# Altium schematic sheet RearBreakoutSchematic.SchDoc
size A; SheetNumber: 1; SheetTotal: 4
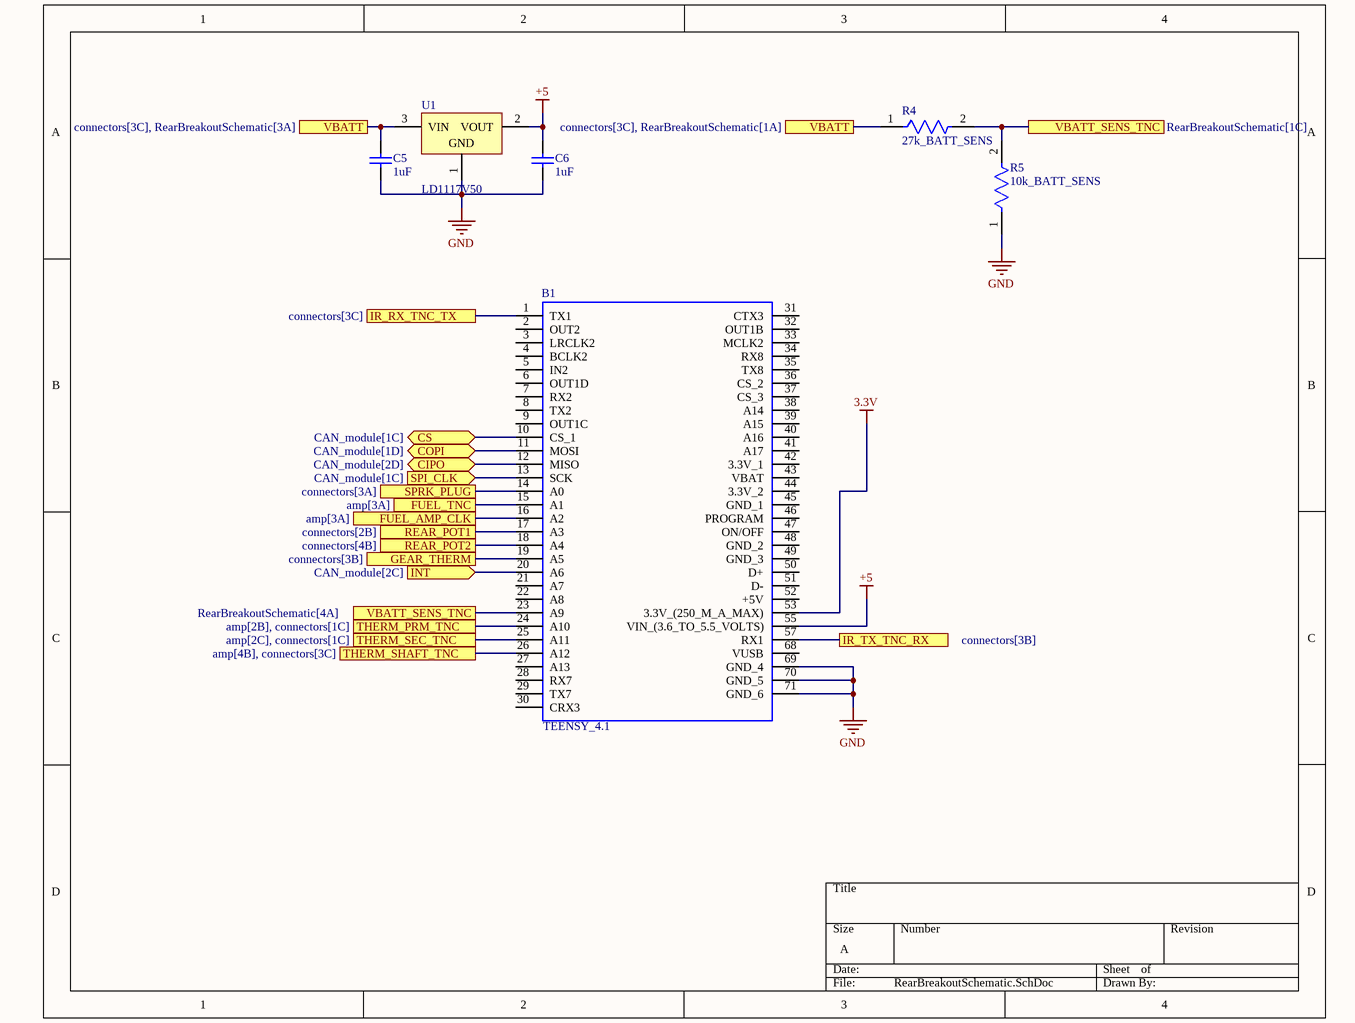
[diagram p0: RearBreakoutSchematic.SchDoc]

## Parts
B1  TEENSY_4.1  [TEENSY41]
C5  1uF  [CAPC2013X145X50LL20T25]
C6  1uF  [CAPC2013X145X50LL20T25]
R4  27k_BATT_SENS  [FP-CRCW0805-e3-IPC_C]
R5  10k_BATT_SENS  [FP-CRCW0805-e3-IPC_C]
U1  LD1117V50  [TO220]

## Ports
CIPO (bidir, see CAN_module[2D]), COPI (bidir, see CAN_module[1D]), CS (bidir, see CAN_module[1C]), FUEL_AMP_CLK (see amp[3A]), FUEL_TNC (see amp[3A]), GEAR_THERM (see connectors[3B]), INT (in, see CAN_module[2C]), IR_RX_TNC_TX (see connectors[3C]), IR_TX_TNC_RX (see connectors[3B]), REAR_POT1 (see connectors[2B]), REAR_POT2 (see connectors[4B]), SPI_CLK (in, see CAN_module[1C]), SPRK_PLUG (see connectors[3A]), THERM_PRM_TNC (see amp[2B], connectors[1C]), THERM_SEC_TNC (see amp[2C], connectors[1C]), THERM_SHAFT_TNC (see amp[4B], connectors[3C]), VBATT (see connectors[3C], RearBreakoutSchematic[1A]), VBATT (see connectors[3C], RearBreakoutSchematic[3A]), VBATT_SENS_TNC (see RearBreakoutSchematic[1C]), VBATT_SENS_TNC (see RearBreakoutSchematic[4A])

## Nets
3.3V: B1.53(3.3V_(250_M_A_MAX))
+5: B1.55(VIN_(3.6_TO_5.5_VOLTS)) C6.2 U1.2(VOUT)
GND: B1.69(GND_4) B1.70(GND_5) B1.71(GND_6) C5.1 C6.1 R5.1 U1.1(GND)
CIPO: B1.12(MISO) ; port CIPO
COPI: B1.11(MOSI) ; port COPI
CS: B1.10(CS_1) ; port CS
FUEL_AMP_CLK: B1.16(A2) ; port FUEL_AMP_CLK
FUEL_TNC: B1.15(A1) ; port FUEL_TNC
GEAR_THERM: B1.19(A5) ; port GEAR_THERM
INT: B1.20(A6) ; port INT
IR_RX_TNC_TX: B1.1(TX1) ; port IR_RX_TNC_TX
IR_TX_TNC_RX: B1.57(RX1) ; port IR_TX_TNC_RX
REAR_POT1: B1.17(A3) ; port REAR_POT1
REAR_POT2: B1.18(A4) ; port REAR_POT2
SPI_CLK: B1.13(SCK) ; port SPI_CLK
SPRK_PLUG: B1.14(A0) ; port SPRK_PLUG
THERM_PRM_TNC: B1.24(A10) ; port THERM_PRM_TNC
THERM_SEC_TNC: B1.25(A11) ; port THERM_SEC_TNC
THERM_SHAFT_TNC: B1.26(A12) ; port THERM_SHAFT_TNC
VBATT: C5.2 R4.1 U1.3(VIN) ; port VBATT
VBATT_SENS_TNC: B1.23(A9) R4.2 R5.2 ; port VBATT_SENS_TNC

Not connected (* = marked no-connect by the designer): B1 2(OUT2) 3(LRCLK2) 4(BCLK2) 5(IN2) 6(OUT1D) 7(RX2) 8(TX2) 9(OUT1C) 21(A7) 22(A8) 27(A13) 28(RX7) 29(TX7) 30(CRX3) 31(CTX3) 32(OUT1B) 33(MCLK2) 34(RX8) 35(TX8) 36(CS_2) 37(CS_3) 38(A14) 39(A15) 40(A16) 41(A17) 42(3.3V_1) 43(VBAT) 44(3.3V_2) 45(GND_1) 46(PROGRAM) 47(ON/OFF) 48(GND_2) 49(GND_3) 50(D+) 51(D-) 52(+5V) 68(VUSB)

## Library data of the parts
B1 = TEENSY_4.1: Teensy 4.1 Development Board; Manufacturer_Name: PJRC; Manufacturer_Part_Number: TEENSY 4.1; Mouser Part Number: *; Mouser Price/Stock: *; Arrow Part Number: *; Arrow Price/Stock: *; Mouser Testing Part Number: *; Mouser Testing Price/Stock: *; Datasheet Link: https://www.pjrc.com/store/teensy41.html
C5 C6 = CMP-1036-04746-2: C0805C105K4PACTU; Manufacturer: Kemet; Part Number: C0805C105K4PACTU
R4 R5 = CMP-02407-009256-1: RES Thick Film, 4.02Ω, 1%, 0.125W, 200ppm/°C, 0805; Resistance: 4.02R; Power Rating: 125mW; Voltage Rating: 150V; Features: Automotive AEC-Q200; Weight: 0.000194oz; Height: 0.02inch; Case Code (Metric): 2012; Composition: Thick Film; Temperature Coefficient: 200ppm/°C; Case/Package: 0805; Min Operating Temperature: -55°C; Width: 0.049inch; Contact Plating: Tin; Packaging: Tape and Reel; Tolerance: 1%; Length: 0.079inch; Lead Free: Lead Free; Case Code (Imperial): 0805; Package Quantity: 5000; Radiation Hardening: No; Max Operating Temperature: 155°C; Number of Terminations: 2; Max Power Dissipation: 125mW; Voltage Rating (DC): 150V
U1 = CMP-0244-00472-1: Fixed Low Drop Positive Voltage Regulator, 5V, 3-Pin TO-220; ComponentLink1URL: http://www.st.com; ComponentLink1Description: Manufacturer URL; DatasheetVersion: 1/11/2011; PackageDescription: TO, Thru-Hole, Vertical, Heatsink Mounted; 3 In-Line Leads; Pitch 2.54 mm; ComponentLink2Description: Datasheet; ComponentLink3URL: http://www.st.com/internet/com/TECHNICAL_RESOURCES/TECHNICAL_LITERATURE/PACKAGE_INFORMATION/CD00004649.pdf; PackageVersion: ver3.0; PackageReference: TO220; ComponentLink2URL: http://www.st.com/internet/com/TECHNICAL_RESOURCES/TECHNICAL_LITERATURE/DATASHEET/CD00000544.pdf; ComponentLink3Description: Package Specification